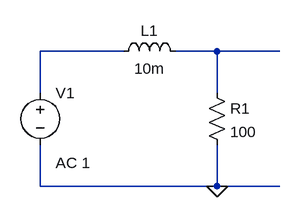
[diagram p0: schematic Series_Indc_Filter_2022023.asc]
Series_Indc_Filter_2022023.asc, the LTspice schematic file:
Version 4
SHEET 1 880 680
WIRE 192 96 64 96
WIRE 336 96 272 96
WIRE 432 96 336 96
WIRE 64 160 64 96
WIRE 336 160 336 96
WIRE 64 304 64 240
WIRE 336 304 336 240
WIRE 336 304 64 304
WIRE 432 304 336 304
FLAG 336 304 0
SYMBOL res 320 144 R0
SYMATTR InstName R1
SYMATTR Value 100
SYMBOL ind 176 112 R270
WINDOW 0 32 56 VTop 2
WINDOW 3 5 56 VBottom 2
SYMATTR InstName L1
SYMATTR Value 10m
SYMBOL voltage 64 144 R0
WINDOW 123 24 124 Left 2
WINDOW 39 0 0 Left 0
SYMATTR Value2 AC 1
SYMATTR InstName V1
SYMATTR Value ""

The netlist it stands for:
* Series_Indc_Filter_2022023.asc
R1 N002 0 100
L1 N001 N002 10m
V1 N001 0 AC 1
.backanno
.end